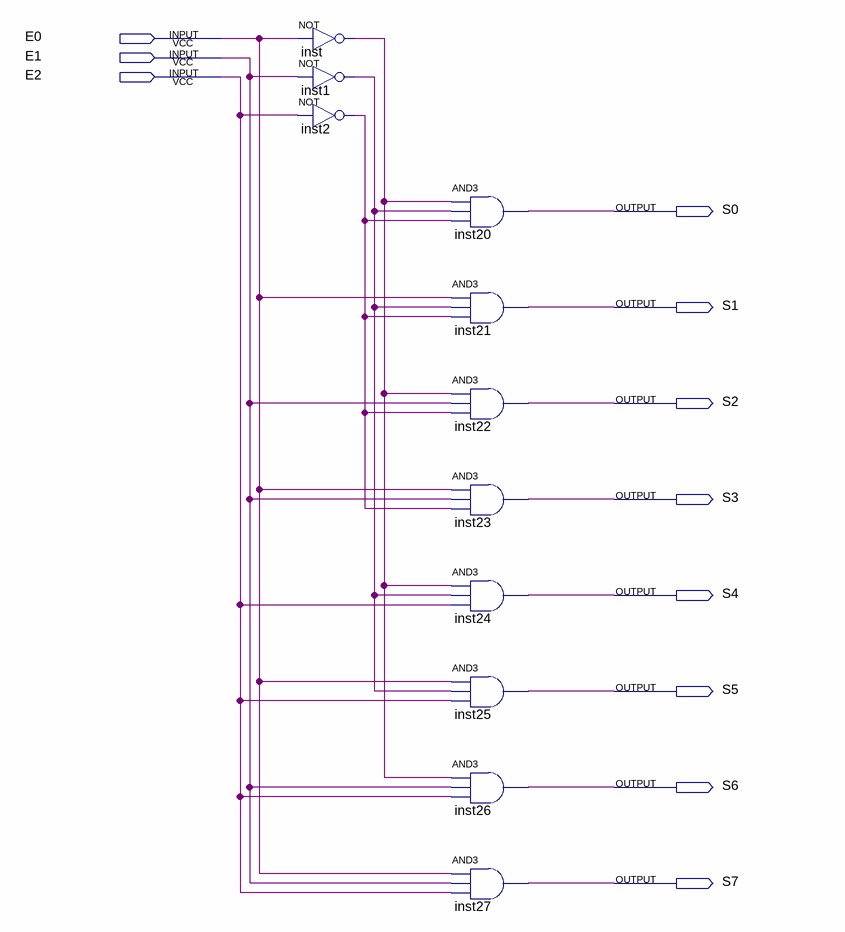
[diagram p0: schematic sheet]
// Quartus schematic decodificador_3x8.bdf as structural Verilog: 11 symbols, 11 pins
module decodificador_3x8 (
  input  E0,
  input  E1,
  input  E2,
  output S0,
  output S1,
  output S2,
  output S3,
  output S4,
  output S5,
  output S6,
  output S7
);

  wire inst1_out, inst2_out, inst_out;

  not inst (inst_out, E0);
  not inst1 (inst1_out, E1);
  not inst2 (inst2_out, E2);
  and inst20 (S0, inst_out, inst1_out, inst2_out);
  and inst21 (S1, E0, inst1_out, inst2_out);
  and inst22 (S2, inst_out, E1, inst2_out);
  and inst23 (S3, E0, E1, inst2_out);
  and inst24 (S4, inst_out, inst1_out, E2);
  and inst25 (S5, E0, inst1_out, E2);
  and inst26 (S6, inst_out, E1, E2);
  and inst27 (S7, E0, E1, E2);
endmodule
